# EasyEDA schematic EasyEDA File - Schematics.json
TITLE: Core Rope Memory; REV: 1.0; Date: 2024-05-01; Sheet: 1/1; Drawn By: Luiz Ferreira; Company: https://bit.ly/coreropememory
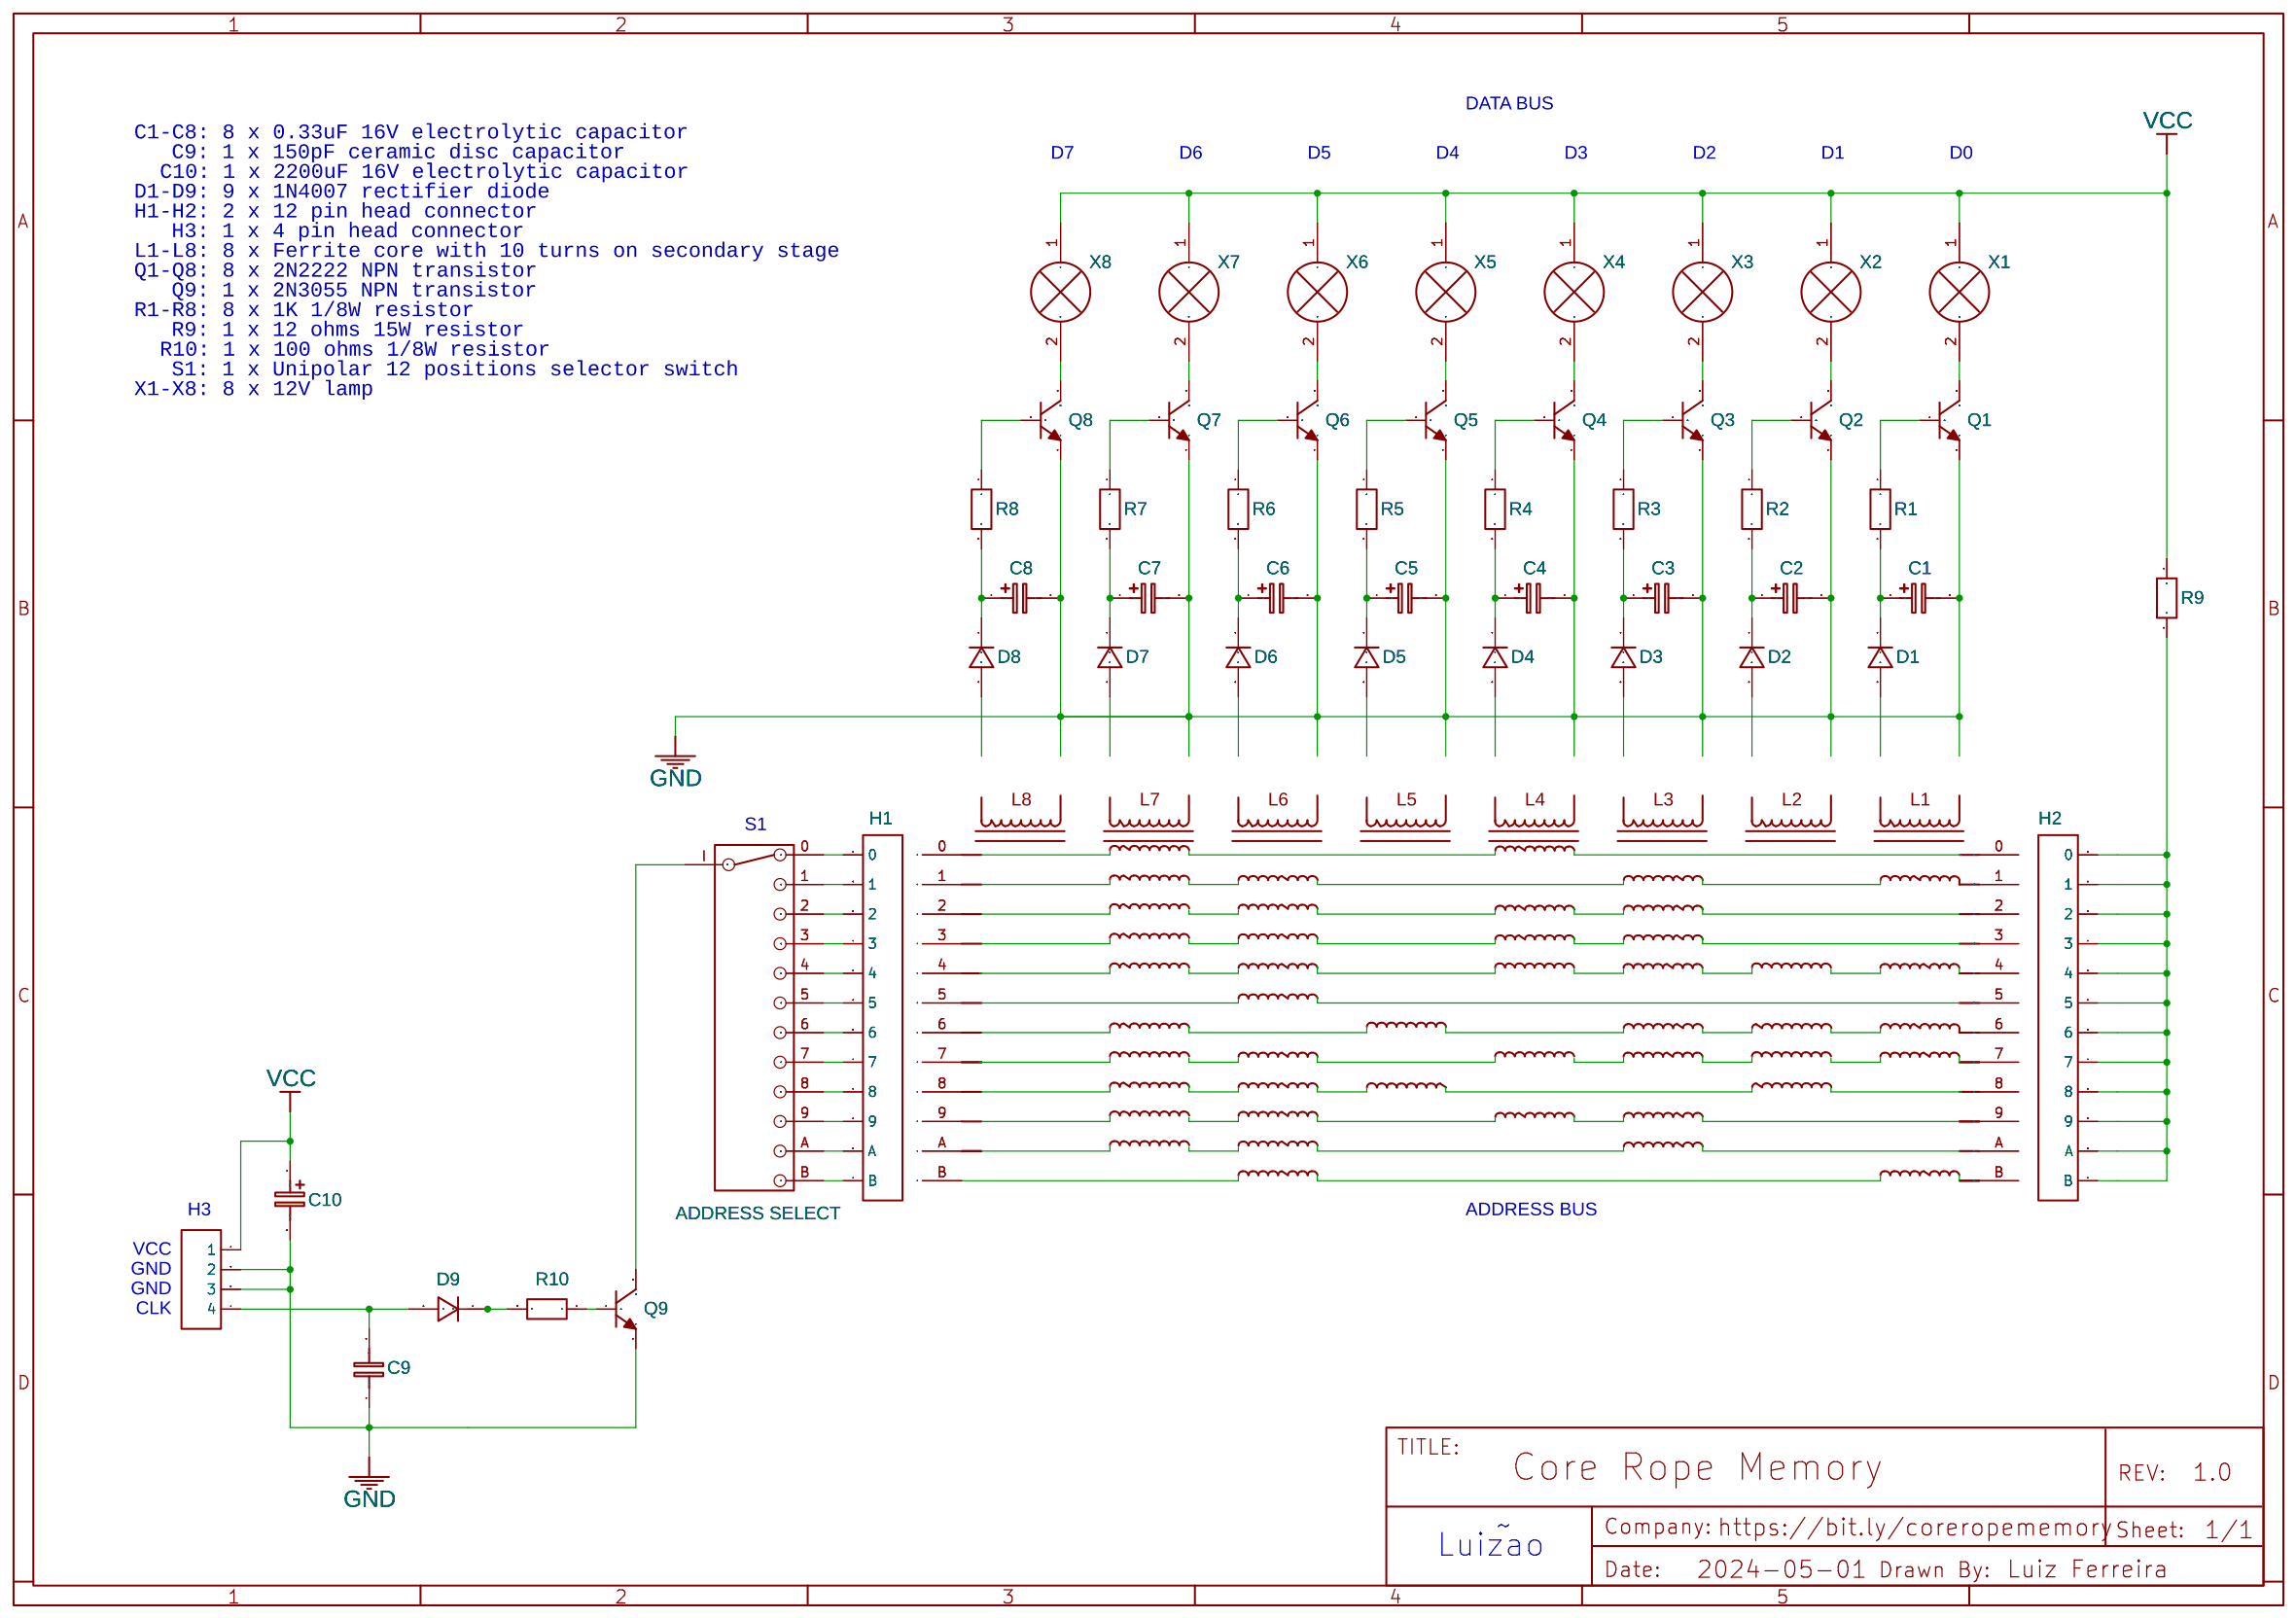
[diagram p0: schematic sheet]

## Parts
C1  1u  [CAP-D6.3×F2.5]
C2  1u  [CAP-D6.3×F2.5]
C3  1u  [CAP-D6.3×F2.5]
C4  1u  [CAP-D6.3×F2.5]
C5  1u  [CAP-D6.3×F2.5]
C6  1u  [CAP-D6.3×F2.5]
C7  1u  [CAP-D6.3×F2.5]
C8  1u  [CAP-D6.3×F2.5]
C9  0.1u  [C0603]
C10  1u  [CAP-D6.3×F2.5]
D1  1N4007W  [SOD-123_L2.8-W1.8-LS3.7-RD]
D2  1N4007W  [SOD-123_L2.8-W1.8-LS3.7-RD]
D3  1N4007W  [SOD-123_L2.8-W1.8-LS3.7-RD]
D4  1N4007W  [SOD-123_L2.8-W1.8-LS3.7-RD]
D5  1N4007W  [SOD-123_L2.8-W1.8-LS3.7-RD]
D6  1N4007W  [SOD-123_L2.8-W1.8-LS3.7-RD]
D7  1N4007W  [SOD-123_L2.8-W1.8-LS3.7-RD]
D8  1N4007W  [SOD-123_L2.8-W1.8-LS3.7-RD]
D9  1N4007W  [SOD-123_L2.8-W1.8-LS3.7-RD]
H1  HDR-F-2.54_1x4  [HDR-F-2.54_1X4]
H1#2  none
H2  none
Q1  2N3904(TO-92)  [TO-92-3_L5.1-W4.1-P1.27-L]
Q2  2N3904(TO-92)  [TO-92-3_L5.1-W4.1-P1.27-L]
Q3  2N3904(TO-92)  [TO-92-3_L5.1-W4.1-P1.27-L]
Q4  2N3904(TO-92)  [TO-92-3_L5.1-W4.1-P1.27-L]
Q5  2N3904(TO-92)  [TO-92-3_L5.1-W4.1-P1.27-L]
Q6  2N3904(TO-92)  [TO-92-3_L5.1-W4.1-P1.27-L]
Q7  2N3904(TO-92)  [TO-92-3_L5.1-W4.1-P1.27-L]
Q8  2N3904(TO-92)  [TO-92-3_L5.1-W4.1-P1.27-L]
Q9  2N3055  [TO-92-3_L5.1-W4.1-P1.27-L]
R1  12R 20W  [R_AXIAL-0.8]
R2  12R 20W  [R_AXIAL-0.8]
R3  12R 20W  [R_AXIAL-0.8]
R4  12R 20W  [R_AXIAL-0.8]
R5  12R 20W  [R_AXIAL-0.8]
R6  12R 20W  [R_AXIAL-0.8]
R7  12R 20W  [R_AXIAL-0.8]
R8  12R 20W  [R_AXIAL-0.8]
R9  12R 20W  [R_AXIAL-0.8]
R10  1k  [R_AXIAL-0.8]
S  ADDRESS SELECT
X  none
X1  none
X2  none
X3  none
X4  none
X5  none
X6  none
X7  none
X8  none

## Library data of the parts
C1-C8 C10 = CE_TH_D6.3×F2.5_EU: Contributor: LCEDA_Lib
C9 = C_0603_EU: Contributor: LCEDA_Lib
D1-D9 = 1N4007W: Supplier: LCSC; Supplier Part: C328592; Manufacturer: BLUE ROCKET; Contributor: LCEDA_Lib
H1 = HDR-F-2.54_1x4: Supplier Part: C225501; Supplier: LCSC; Contributor: LCEDA_Lib
Q1-Q9 = 2N3904(TO-92): Supplier: LCSC; Manufacturer: SEMTECH; Manufacturer Part: 2N3904; Supplier Part: C118538; Contributor: LCEDA_Lib
R1-R10 = R_AXIAL-0.8_EU: Contributor: LCEDA_Lib

## Nets
GND: C1.2 C2.2 C3.2 C4.2 C5.2 C6.2 C7.2 C8.2 C9.1 C10.2 H1.2 H1.3 Q1.1(E) Q2.1(E) Q3.1(E) Q4.1(E) Q5.1(E) Q6.1(E) Q7.1(E) Q8.1(E) Q9.1(E)
VCC: C10.1 H1.1 R9.1 X1.1 X2.1 X3.1 X4.1 X5.1 X6.1 X7.1 X8.1
Net-(C1-1): C1.1 D1.1 R1.2
Net-(C2-1): C2.1 D2.1 R2.2
Net-(C3-1): C3.1 D3.1 R3.2
Net-(C4-1): C4.1 D4.1 R4.2
Net-(C5-1): C5.1 D5.1 R5.2
Net-(C6-1): C6.1 D6.1 R6.2
Net-(C7-1): C7.1 D7.1 R7.2
Net-(C8-1): C8.1 D8.1 R8.2
Net-(C9-2): C9.2 D9.2 H1.4
Net-(D9-1): D9.1 R10.2
Net-(H1#2-1): H1#2.1(0) S.0(1) S.4(3) S.8(3)
Net-(H1#2-2): H1#2.2(9) S.1(3) S.5(3) S.9(3)
Net-(H1#2-3): H1#2.3(A) S.2(3) S.6(3) S.A(3)
Net-(H1#2-4): H1#2.4(B) S.3 S.7(3) S.B(3)
Net-(H2-1): H2.1(0) H2.2(9) H2.3(A) H2.4(B) R9.2
Net-(Q1-2): Q1.2(B) R1.1
Net-(Q1-3): Q1.3(C) X1.2
Net-(Q2-2): Q2.2(B) R2.1
Net-(Q2-3): Q2.3(C) X2.2
Net-(Q3-2): Q3.2(B) R3.1
Net-(Q3-3): Q3.3(C) X3.2
Net-(Q4-2): Q4.2(B) R4.1
Net-(Q4-3): Q4.3(C) X4.2
Net-(Q5-2): Q5.2(B) R5.1
Net-(Q5-3): Q5.3(C) X5.2
Net-(Q6-2): Q6.2(B) R6.1
Net-(Q6-3): Q6.3(C) X6.2
Net-(Q7-2): Q7.2(B) R7.1
Net-(Q7-3): Q7.3(C) X7.2
Net-(Q8-2): Q8.2(B) R8.1
Net-(Q8-3): Q8.3(C) X8.2
Net-(Q9-2): Q9.2(B) R10.1
Net-(Q9-3): Q9.3(C) S.I(2)

Not connected (* = marked no-connect by the designer): D1 2; D2 2; D3 2; D4 2; D5 2; D6 2; D7 2; D8 2; X 0(1) 1 2 3(2) 4(2) 5(2) 6(2) 7(2) 8(2) 9(2) A(2) B(2)

## Notes on the sheet
- DATA BUS
- C1-C8: 8 x 0.33uF 16V electrolytic capacitor
- C9: 1 x 150pF ceramic disc capacitor
- D7
- D6
- D5
- D4
- D3
- D2
- D1
- D0
- D1-D9: 9 x 1N4007 rectifier diode
- C10: 1 x 2200uF 16V electrolytic capacitor
- H1-H2: 2 x 12 pin head connector
- H3: 1 x 4 pin head connector
- L1-L8: 8 x Ferrite core with 10 turns on secondary stage
- Q1-Q8: 8 x 2N2222 NPN transistor
- R1-R8: 8 x 1K 1/8W resistor
- Q9: 1 x 2N3055 NPN transistor
- R9: 1 x 12 ohms 15W resistor
- R10: 1 x 100 ohms 1/8W resistor
- S1: 1 x Unipolar 12 positions selector switch
- X1-X8: 8 x 12V lamp
- S1
- H3
- ADDRESS BUS
- VCC
- GND
- GND
- CLK
- ~
- Luizao
